# EAGLE design bop_pcb (EAGLE 9.6.2)
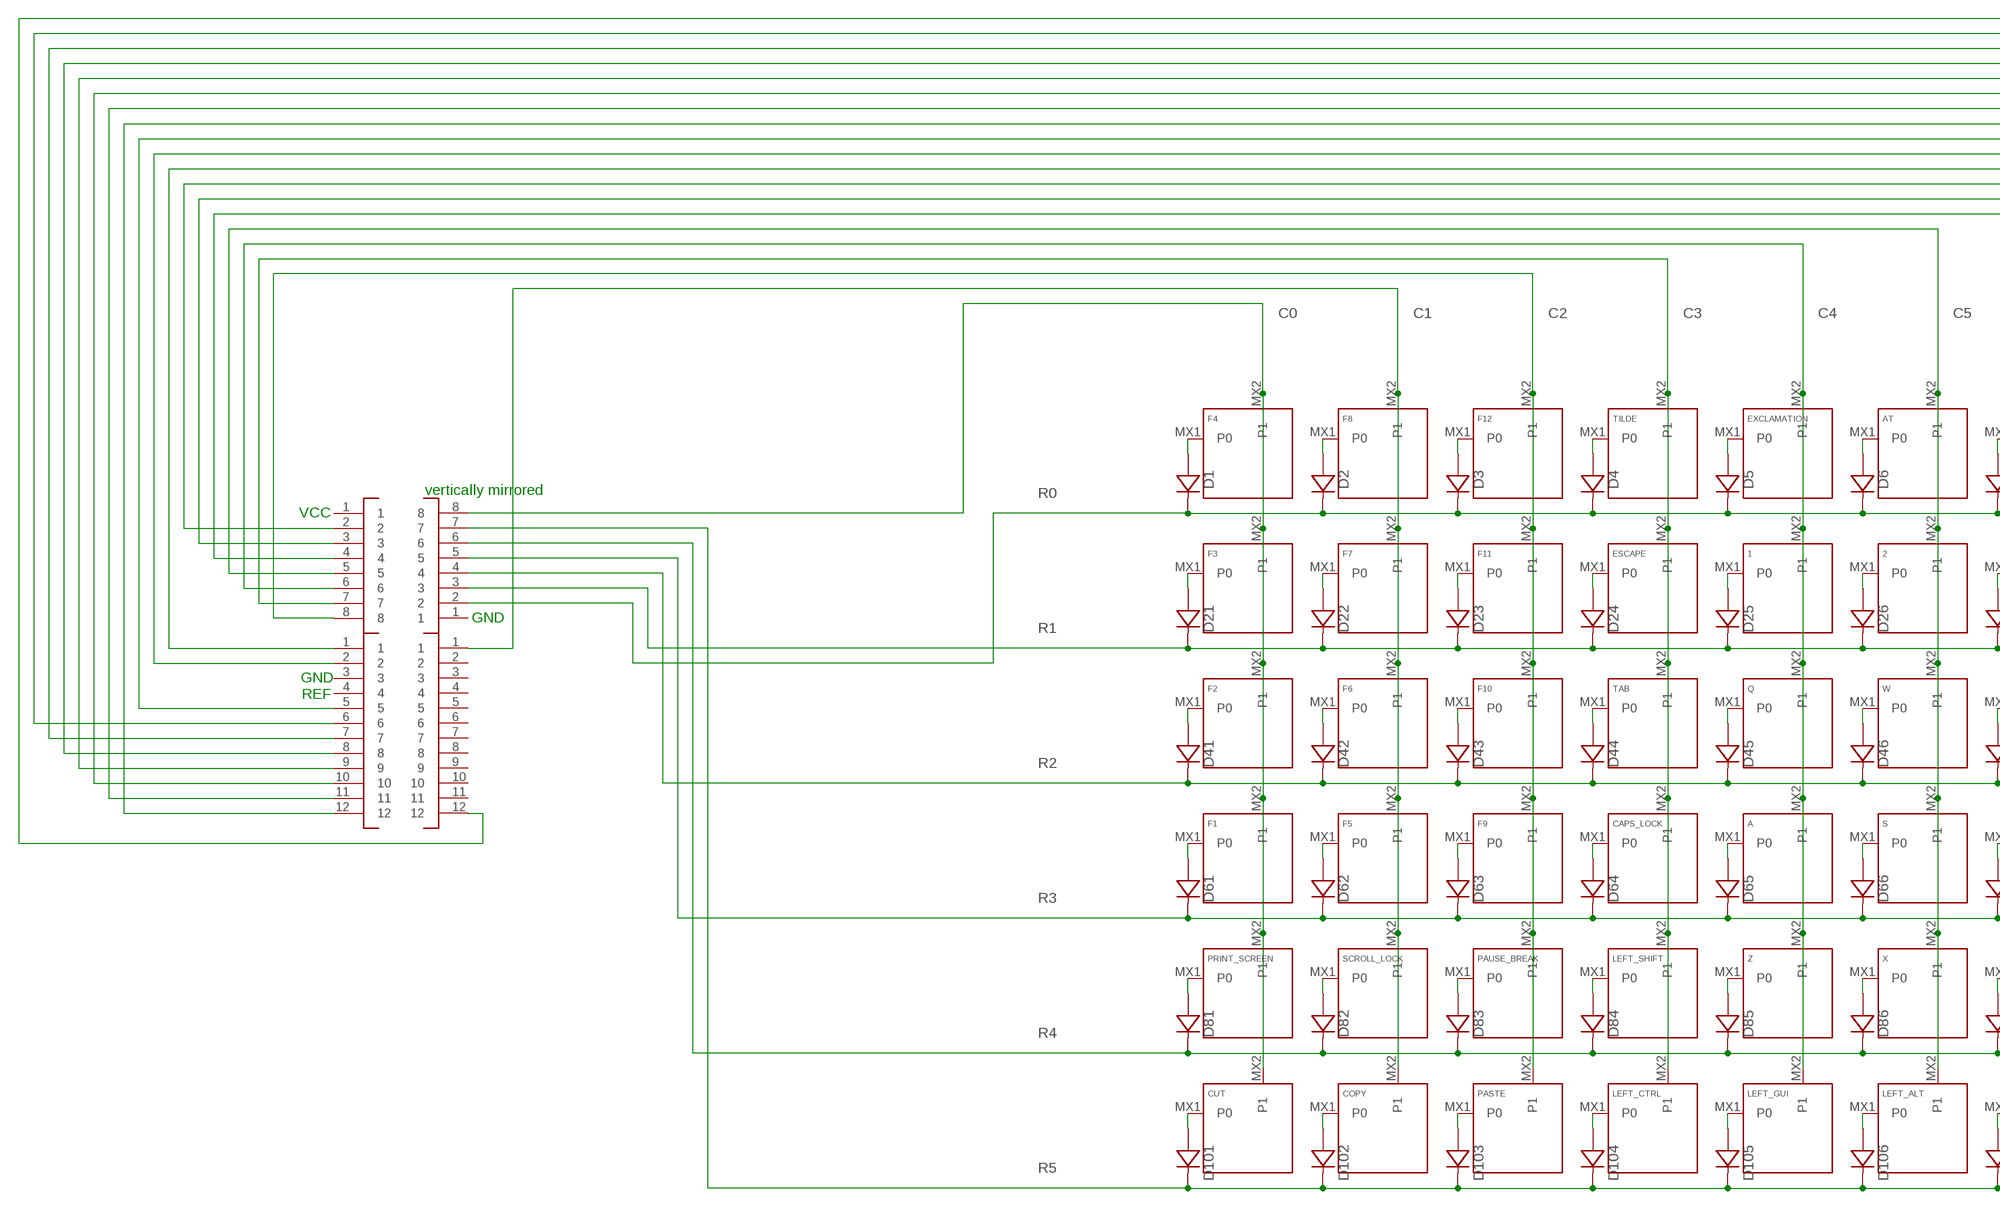
[diagram p0: schematic, sheet 1, part 1 of 2]
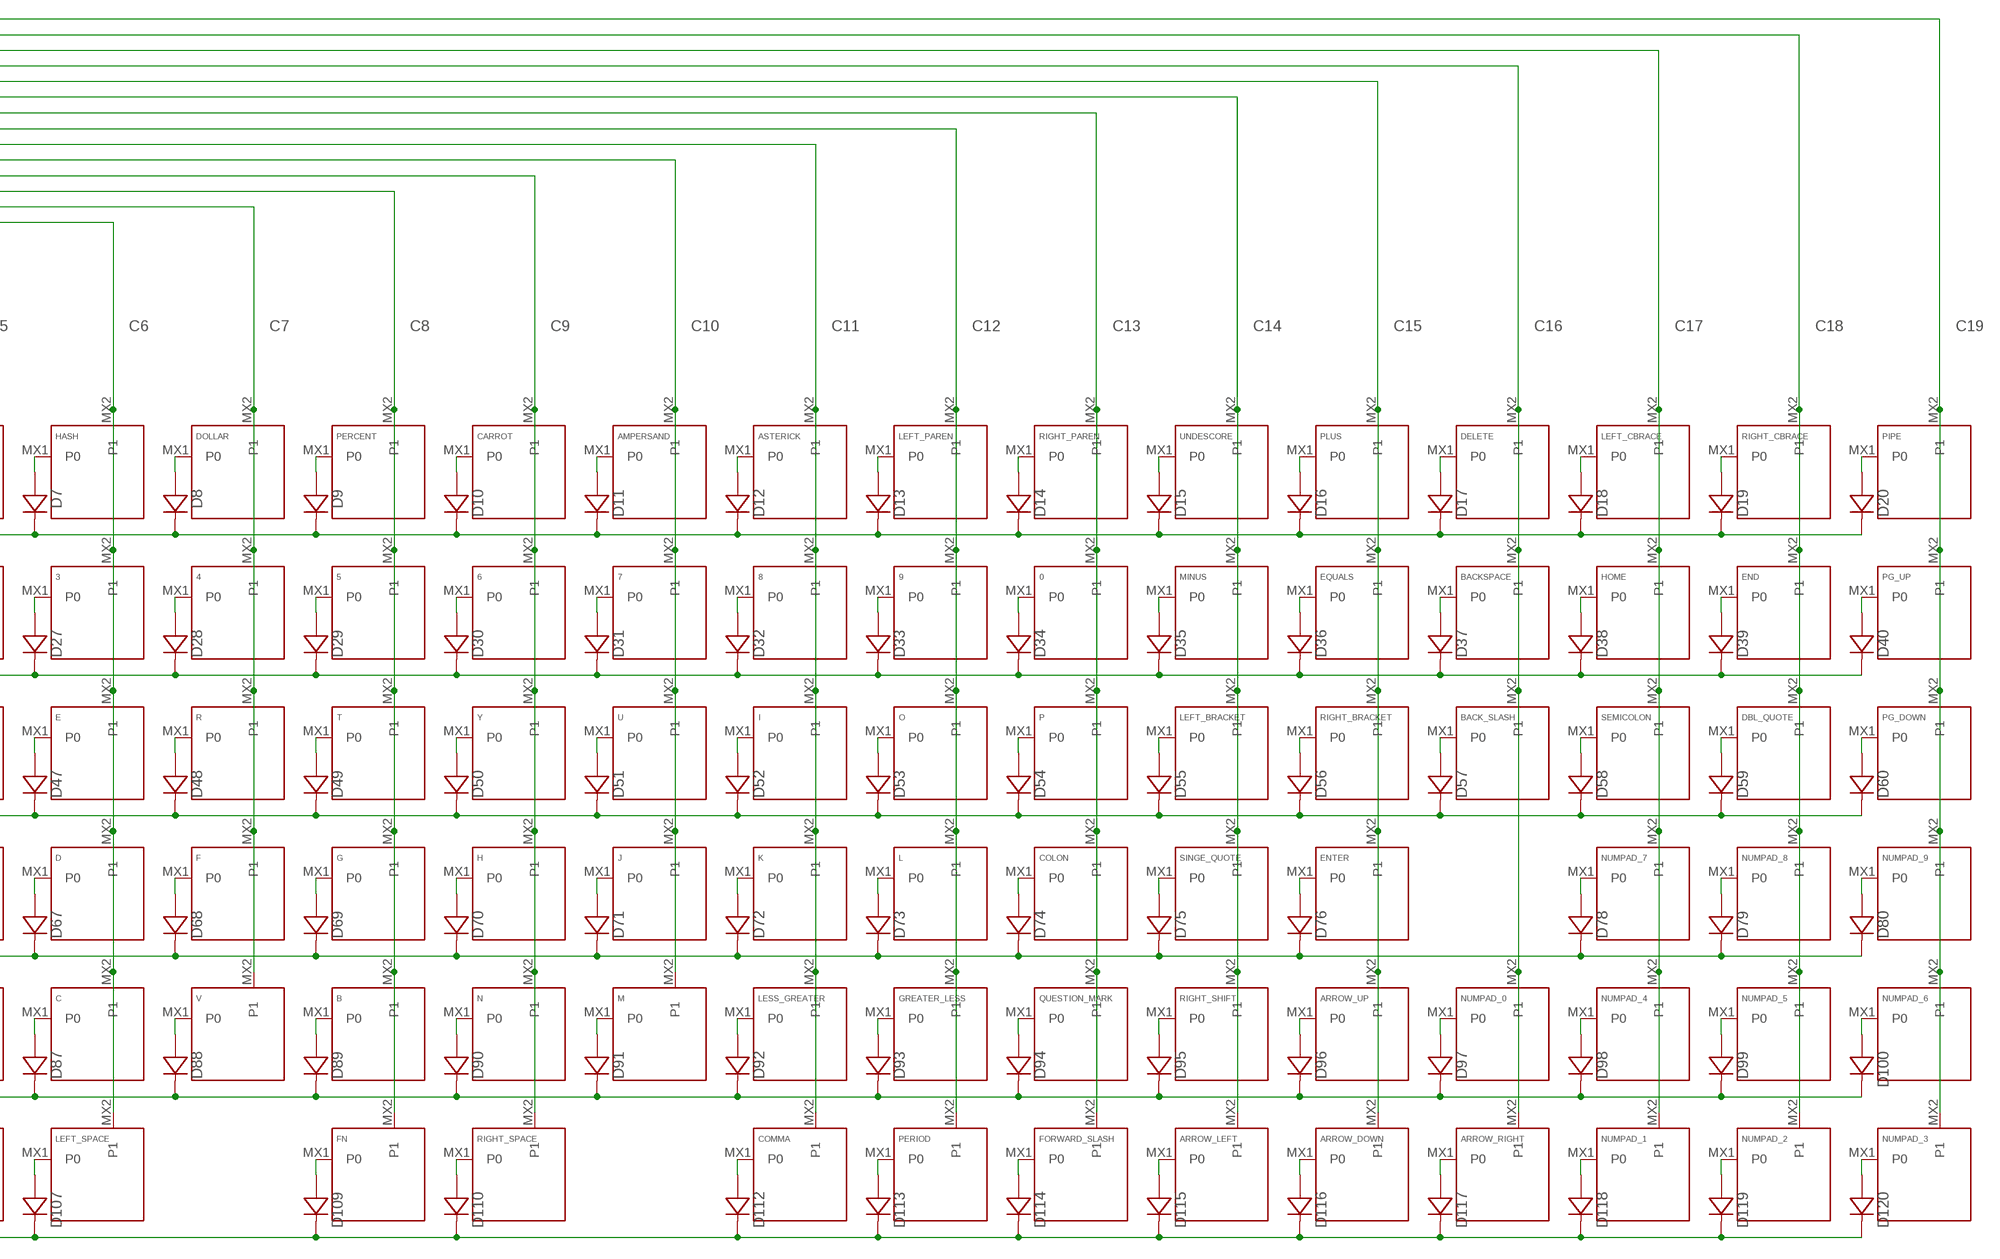
[diagram p1: schematic, sheet 1, part 2 of 2]

## Parts
0  KEYSWITCH-PLAIN-MX-1U  [MX-1U]
1  KEYSWITCH-PLAIN-MX-1U  [MX-1U]
2  KEYSWITCH-PLAIN-MX-1U  [MX-1U]
3  KEYSWITCH-PLAIN-MX-1U  [MX-1U]
4  KEYSWITCH-PLAIN-MX-1U  [MX-1U]
5  KEYSWITCH-PLAIN-MX-1U  [MX-1U]
6  KEYSWITCH-PLAIN-MX-1U  [MX-1U]
7  KEYSWITCH-PLAIN-MX-1U  [MX-1U]
8  KEYSWITCH-PLAIN-MX-1U  [MX-1U]
9  KEYSWITCH-PLAIN-MX-1U  [MX-1U]
A  KEYSWITCH-PLAIN-MX-1U  [MX-1U]
AMPERSAND  KEYSWITCH-PLAIN-MX-1U  [MX-1U]
ARROW_DOWN  KEYSWITCH-PLAIN-MX-1U  [MX-1U]
ARROW_LEFT  KEYSWITCH-PLAIN-MX-1U  [MX-1U]
ARROW_RIGHT  KEYSWITCH-PLAIN-MX-1U  [MX-1U]
ARROW_UP  KEYSWITCH-PLAIN-MX-1U  [MX-1U]
ASTERICK  KEYSWITCH-PLAIN-MX-1U  [MX-1U]
AT  KEYSWITCH-PLAIN-MX-1U  [MX-1U]
B  KEYSWITCH-PLAIN-MX-1U  [MX-1U]
BACK_SLASH  KEYSWITCH-PLAIN-MX-1U  [MX-1U]
BACKSPACE  KEYSWITCH-PLAIN-MX-1U  [MX-1U]
C  KEYSWITCH-PLAIN-MX-1U  [MX-1U]
CAPS_LOCK  KEYSWITCH-PLAIN-MX-1U  [MX-1U]
CARROT  KEYSWITCH-PLAIN-MX-1U  [MX-1U]
COLON  KEYSWITCH-PLAIN-MX-1U  [MX-1U]
COMMA  KEYSWITCH-PLAIN-MX-1U  [MX-1U]
COPY  KEYSWITCH-PLAIN-MX-1U  [MX-1U]
CUT  KEYSWITCH-PLAIN-MX-1U  [MX-1U]
D  KEYSWITCH-PLAIN-MX-1U  [MX-1U]
D1  DIODE-SOD-123  [SOD-123]
D2  DIODE-SOD-123  [SOD-123]
D3  DIODE-SOD-123  [SOD-123]
D4  DIODE-SOD-123  [SOD-123]
D5  DIODE-SOD-123  [SOD-123]
D6  DIODE-SOD-123  [SOD-123]
D7  DIODE-SOD-123  [SOD-123]
D8  DIODE-SOD-123  [SOD-123]
D9  DIODE-SOD-123  [SOD-123]
D10  DIODE-SOD-123  [SOD-123]
D11  DIODE-SOD-123  [SOD-123]
D12  DIODE-SOD-123  [SOD-123]
D13  DIODE-SOD-123  [SOD-123]
D14  DIODE-SOD-123  [SOD-123]
D15  DIODE-SOD-123  [SOD-123]
D16  DIODE-SOD-123  [SOD-123]
D17  DIODE-SOD-123  [SOD-123]
D18  DIODE-SOD-123  [SOD-123]
D19  DIODE-SOD-123  [SOD-123]
D20  DIODE-SOD-123  [SOD-123]
D21  DIODE-SOD-123  [SOD-123]
D22  DIODE-SOD-123  [SOD-123]
D23  DIODE-SOD-123  [SOD-123]
D24  DIODE-SOD-123  [SOD-123]
D25  DIODE-SOD-123  [SOD-123]
D26  DIODE-SOD-123  [SOD-123]
D27  DIODE-SOD-123  [SOD-123]
D28  DIODE-SOD-123  [SOD-123]
D29  DIODE-SOD-123  [SOD-123]
D30  DIODE-SOD-123  [SOD-123]
D31  DIODE-SOD-123  [SOD-123]
D32  DIODE-SOD-123  [SOD-123]
D33  DIODE-SOD-123  [SOD-123]
D34  DIODE-SOD-123  [SOD-123]
D35  DIODE-SOD-123  [SOD-123]
D36  DIODE-SOD-123  [SOD-123]
D37  DIODE-SOD-123  [SOD-123]
D38  DIODE-SOD-123  [SOD-123]
D39  DIODE-SOD-123  [SOD-123]
D40  DIODE-SOD-123  [SOD-123]
D41  DIODE-SOD-123  [SOD-123]
D42  DIODE-SOD-123  [SOD-123]
D43  DIODE-SOD-123  [SOD-123]
D44  DIODE-SOD-123  [SOD-123]
D45  DIODE-SOD-123  [SOD-123]
D46  DIODE-SOD-123  [SOD-123]
D47  DIODE-SOD-123  [SOD-123]
D48  DIODE-SOD-123  [SOD-123]
D49  DIODE-SOD-123  [SOD-123]
D50  DIODE-SOD-123  [SOD-123]
D51  DIODE-SOD-123  [SOD-123]
D52  DIODE-SOD-123  [SOD-123]
D53  DIODE-SOD-123  [SOD-123]
D54  DIODE-SOD-123  [SOD-123]
D55  DIODE-SOD-123  [SOD-123]
D56  DIODE-SOD-123  [SOD-123]
D57  DIODE-SOD-123  [SOD-123]
D58  DIODE-SOD-123  [SOD-123]
D59  DIODE-SOD-123  [SOD-123]
D60  DIODE-SOD-123  [SOD-123]
D61  DIODE-SOD-123  [SOD-123]
D62  DIODE-SOD-123  [SOD-123]
D63  DIODE-SOD-123  [SOD-123]
D64  DIODE-SOD-123  [SOD-123]
D65  DIODE-SOD-123  [SOD-123]
D66  DIODE-SOD-123  [SOD-123]
D67  DIODE-SOD-123  [SOD-123]
D68  DIODE-SOD-123  [SOD-123]
D69  DIODE-SOD-123  [SOD-123]
D70  DIODE-SOD-123  [SOD-123]
D71  DIODE-SOD-123  [SOD-123]
D72  DIODE-SOD-123  [SOD-123]
D73  DIODE-SOD-123  [SOD-123]
D74  DIODE-SOD-123  [SOD-123]
D75  DIODE-SOD-123  [SOD-123]
D76  DIODE-SOD-123  [SOD-123]
D78  DIODE-SOD-123  [SOD-123]
D79  DIODE-SOD-123  [SOD-123]
D80  DIODE-SOD-123  [SOD-123]
D81  DIODE-SOD-123  [SOD-123]
D82  DIODE-SOD-123  [SOD-123]
D83  DIODE-SOD-123  [SOD-123]
D84  DIODE-SOD-123  [SOD-123]
D85  DIODE-SOD-123  [SOD-123]
D86  DIODE-SOD-123  [SOD-123]
D87  DIODE-SOD-123  [SOD-123]
D88  DIODE-SOD-123  [SOD-123]
D89  DIODE-SOD-123  [SOD-123]
D90  DIODE-SOD-123  [SOD-123]
D91  DIODE-SOD-123  [SOD-123]
D92  DIODE-SOD-123  [SOD-123]
D93  DIODE-SOD-123  [SOD-123]
D94  DIODE-SOD-123  [SOD-123]
D95  DIODE-SOD-123  [SOD-123]
D96  DIODE-SOD-123  [SOD-123]
D97  DIODE-SOD-123  [SOD-123]
D98  DIODE-SOD-123  [SOD-123]
D99  DIODE-SOD-123  [SOD-123]
D100  DIODE-SOD-123  [SOD-123]
D101  DIODE-SOD-123  [SOD-123]
D102  DIODE-SOD-123  [SOD-123]
D103  DIODE-SOD-123  [SOD-123]
D104  DIODE-SOD-123  [SOD-123]
D105  DIODE-SOD-123  [SOD-123]
D106  DIODE-SOD-123  [SOD-123]
D107  DIODE-SOD-123  [SOD-123]
D109  DIODE-SOD-123  [SOD-123]
D110  DIODE-SOD-123  [SOD-123]
D112  DIODE-SOD-123  [SOD-123]
D113  DIODE-SOD-123  [SOD-123]
D114  DIODE-SOD-123  [SOD-123]
D115  DIODE-SOD-123  [SOD-123]
D116  DIODE-SOD-123  [SOD-123]
D117  DIODE-SOD-123  [SOD-123]
D118  DIODE-SOD-123  [SOD-123]
D119  DIODE-SOD-123  [SOD-123]
D120  DIODE-SOD-123  [SOD-123]
DBL_QUOTE  KEYSWITCH-PLAIN-MX-1U  [MX-1U]
DELETE  KEYSWITCH-PLAIN-MX-1U  [MX-1U]
DOLLAR  KEYSWITCH-PLAIN-MX-1U  [MX-1U]
E  KEYSWITCH-PLAIN-MX-1U  [MX-1U]
END  KEYSWITCH-PLAIN-MX-1U  [MX-1U]
ENTER  KEYSWITCH-PLAIN-MX-1U  [MX-1U]
EQUALS  KEYSWITCH-PLAIN-MX-1U  [MX-1U]
ESCAPE  KEYSWITCH-PLAIN-MX-1U  [MX-1U]
EXCLAMATION  KEYSWITCH-PLAIN-MX-1U  [MX-1U]
F  KEYSWITCH-PLAIN-MX-1U  [MX-1U]
F1  KEYSWITCH-PLAIN-MX-1U  [MX-1U]
F2  KEYSWITCH-PLAIN-MX-1U  [MX-1U]
F3  KEYSWITCH-PLAIN-MX-1U  [MX-1U]
F4  KEYSWITCH-PLAIN-MX-1U  [MX-1U]
F5  KEYSWITCH-PLAIN-MX-1U  [MX-1U]
F6  KEYSWITCH-PLAIN-MX-1U  [MX-1U]
F7  KEYSWITCH-PLAIN-MX-1U  [MX-1U]
F8  KEYSWITCH-PLAIN-MX-1U  [MX-1U]
F9  KEYSWITCH-PLAIN-MX-1U  [MX-1U]
F10  KEYSWITCH-PLAIN-MX-1U  [MX-1U]
F11  KEYSWITCH-PLAIN-MX-1U  [MX-1U]
F12  KEYSWITCH-PLAIN-MX-1U  [MX-1U]
FN  KEYSWITCH-PLAIN-MX-1U  [MX-1U]
FORWARD_SLASH  KEYSWITCH-PLAIN-MX-1U  [MX-1U]
G  KEYSWITCH-PLAIN-MX-1U  [MX-1U]
GREATER_LESS  KEYSWITCH-PLAIN-MX-1U  [MX-1U]
H  KEYSWITCH-PLAIN-MX-1U  [MX-1U]
HASH  KEYSWITCH-PLAIN-MX-1U  [MX-1U]
HOME  KEYSWITCH-PLAIN-MX-1U  [MX-1U]
I  KEYSWITCH-PLAIN-MX-1U  [MX-1U]
J  KEYSWITCH-PLAIN-MX-1U  [MX-1U]
J1  HEADER-12X1-2.54-ROUND  [HEADER-12X1-2.54-ROUND]
J2  HEADER-12X1-2.54-ROUND  [HEADER-12X1-2.54-ROUND]
K  KEYSWITCH-PLAIN-MX-1U  [MX-1U]
L  KEYSWITCH-PLAIN-MX-1U  [MX-1U]
LEFT_ALT  KEYSWITCH-PLAIN-MX-1U  [MX-1U]
LEFT_BRACKET  KEYSWITCH-PLAIN-MX-1U  [MX-1U]
LEFT_CBRACE  KEYSWITCH-PLAIN-MX-1U  [MX-1U]
LEFT_CTRL  KEYSWITCH-PLAIN-MX-1U  [MX-1U]
LEFT_GUI  KEYSWITCH-PLAIN-MX-1U  [MX-1U]
LEFT_PAREN  KEYSWITCH-PLAIN-MX-1U  [MX-1U]
LEFT_SHIFT  KEYSWITCH-PLAIN-MX-1U  [MX-1U]
LEFT_SPACE  KEYSWITCH-PLAIN-MX-2U-FLIPPED  [MX-2U-FLIPPED]
LESS_GREATER  KEYSWITCH-PLAIN-MX-1U  [MX-1U]
M  KEYSWITCH-PLAIN-MX-1U  [MX-1U]
MINUS  KEYSWITCH-PLAIN-MX-1U  [MX-1U]
N  KEYSWITCH-PLAIN-MX-1U  [MX-1U]
NUMPAD_0  KEYSWITCH-PLAIN-MX-2U-ROTATED  [MX-2U-ROTATED]
NUMPAD_1  KEYSWITCH-PLAIN-MX-1U  [MX-1U]
NUMPAD_2  KEYSWITCH-PLAIN-MX-1U  [MX-1U]
NUMPAD_3  KEYSWITCH-PLAIN-MX-1U  [MX-1U]
NUMPAD_4  KEYSWITCH-PLAIN-MX-1U  [MX-1U]
NUMPAD_5  KEYSWITCH-PLAIN-MX-1U  [MX-1U]
NUMPAD_6  KEYSWITCH-PLAIN-MX-1U  [MX-1U]
NUMPAD_7  KEYSWITCH-PLAIN-MX-1U  [MX-1U]
NUMPAD_8  KEYSWITCH-PLAIN-MX-1U  [MX-1U]
NUMPAD_9  KEYSWITCH-PLAIN-MX-1U  [MX-1U]
O  KEYSWITCH-PLAIN-MX-1U  [MX-1U]
P  KEYSWITCH-PLAIN-MX-1U  [MX-1U]
PASTE  KEYSWITCH-PLAIN-MX-1U  [MX-1U]
PAUSE_BREAK  KEYSWITCH-PLAIN-MX-1U  [MX-1U]
PERCENT  KEYSWITCH-PLAIN-MX-1U  [MX-1U]
PERIOD  KEYSWITCH-PLAIN-MX-1U  [MX-1U]
PG_DOWN  KEYSWITCH-PLAIN-MX-1U  [MX-1U]
PG_UP  KEYSWITCH-PLAIN-MX-1U  [MX-1U]
PIPE  KEYSWITCH-PLAIN-MX-1U  [MX-1U]
PLUS  KEYSWITCH-PLAIN-MX-1U  [MX-1U]
PRINT_SCREEN  KEYSWITCH-PLAIN-MX-1U  [MX-1U]
Q  KEYSWITCH-PLAIN-MX-1U  [MX-1U]
QUESTION_MARK  KEYSWITCH-PLAIN-MX-1U  [MX-1U]
R  KEYSWITCH-PLAIN-MX-1U  [MX-1U]
RIGHT_BRACKET  KEYSWITCH-PLAIN-MX-1U  [MX-1U]
RIGHT_CBRACE  KEYSWITCH-PLAIN-MX-1U  [MX-1U]
RIGHT_PAREN  KEYSWITCH-PLAIN-MX-1U  [MX-1U]
RIGHT_SHIFT  KEYSWITCH-PLAIN-MX-1U  [MX-1U]
RIGHT_SPACE  KEYSWITCH-PLAIN-MX-2U-FLIPPED  [MX-2U-FLIPPED]
S  KEYSWITCH-PLAIN-MX-1U  [MX-1U]
SCROLL_LOCK  KEYSWITCH-PLAIN-MX-1U  [MX-1U]
SEMICOLON  KEYSWITCH-PLAIN-MX-1U  [MX-1U]
SINGE_QUOTE  KEYSWITCH-PLAIN-MX-1U  [MX-1U]
T  KEYSWITCH-PLAIN-MX-1U  [MX-1U]
TAB  KEYSWITCH-PLAIN-MX-1U  [MX-1U]
TILDE  KEYSWITCH-PLAIN-MX-1U  [MX-1U]
U  KEYSWITCH-PLAIN-MX-1U  [MX-1U]
U$1  HEADER-8X1-2.54  [HEADER-8X1-2.54]
U$2  HEADER-8X1-2.54  [HEADER-8X1-2.54]
UNDESCORE  KEYSWITCH-PLAIN-MX-1U  [MX-1U]
V  KEYSWITCH-PLAIN-MX-1U  [MX-1U]
W  KEYSWITCH-PLAIN-MX-1U  [MX-1U]
X  KEYSWITCH-PLAIN-MX-1U  [MX-1U]
Y  KEYSWITCH-PLAIN-MX-1U  [MX-1U]
Z  KEYSWITCH-PLAIN-MX-1U  [MX-1U]

## Nets
C0: CUT.MX2(P1) F1.MX2(P1) F2.MX2(P1) F3.MX2(P1) F4.MX2(P1) PRINT_SCREEN.MX2(P1) U$2.8
C1: COPY.MX2(P1) F5.MX2(P1) F6.MX2(P1) F7.MX2(P1) F8.MX2(P1) J1.1 SCROLL_LOCK.MX2(P1)
C2: F9.MX2(P1) F10.MX2(P1) F11.MX2(P1) F12.MX2(P1) PASTE.MX2(P1) PAUSE_BREAK.MX2(P1) U$1.8
C3: CAPS_LOCK.MX2(P1) ESCAPE.MX2(P1) LEFT_CTRL.MX2(P1) LEFT_SHIFT.MX2(P1) TAB.MX2(P1) TILDE.MX2(P1) U$1.7
C4: 1.MX2(P1) A.MX2(P1) EXCLAMATION.MX2(P1) LEFT_GUI.MX2(P1) Q.MX2(P1) U$1.6 Z.MX2(P1)
C5: 2.MX2(P1) AT.MX2(P1) LEFT_ALT.MX2(P1) S.MX2(P1) U$1.5 W.MX2(P1) X.MX2(P1)
C6: 3.MX2(P1) C.MX2(P1) D.MX2(P1) E.MX2(P1) HASH.MX2(P1) LEFT_SPACE.MX2(P1) U$1.4
C7: 4.MX2(P1) DOLLAR.MX2(P1) F.MX2(P1) R.MX2(P1) U$1.3 V.MX2(P1)
C8: 5.MX2(P1) B.MX2(P1) FN.MX2(P1) G.MX2(P1) PERCENT.MX2(P1) T.MX2(P1) U$1.2
C9: 6.MX2(P1) CARROT.MX2(P1) H.MX2(P1) J2.1 N.MX2(P1) RIGHT_SPACE.MX2(P1) Y.MX2(P1)
C10: 7.MX2(P1) AMPERSAND.MX2(P1) J2.2 J.MX2(P1) M.MX2(P1) U.MX2(P1)
C11: 8.MX2(P1) ASTERICK.MX2(P1) COMMA.MX2(P1) I.MX2(P1) J2.5 K.MX2(P1) LESS_GREATER.MX2(P1)
C12: 9.MX2(P1) GREATER_LESS.MX2(P1) J2.12 L.MX2(P1) LEFT_PAREN.MX2(P1) O.MX2(P1) PERIOD.MX2(P1)
C13: 0.MX2(P1) COLON.MX2(P1) FORWARD_SLASH.MX2(P1) J2.11 P.MX2(P1) QUESTION_MARK.MX2(P1) RIGHT_PAREN.MX2(P1)
C14: ARROW_LEFT.MX2(P1) J2.10 LEFT_BRACKET.MX2(P1) MINUS.MX2(P1) RIGHT_SHIFT.MX2(P1) SINGE_QUOTE.MX2(P1) UNDESCORE.MX2(P1)
C15: ARROW_DOWN.MX2(P1) ARROW_UP.MX2(P1) ENTER.MX2(P1) EQUALS.MX2(P1) J2.9 PLUS.MX2(P1) RIGHT_BRACKET.MX2(P1)
C16: ARROW_RIGHT.MX2(P1) BACK_SLASH.MX2(P1) BACKSPACE.MX2(P1) DELETE.MX2(P1) J2.8 NUMPAD_0.MX2(P1)
C17: HOME.MX2(P1) J2.7 LEFT_CBRACE.MX2(P1) NUMPAD_1.MX2(P1) NUMPAD_4.MX2(P1) NUMPAD_7.MX2(P1) SEMICOLON.MX2(P1)
C18: DBL_QUOTE.MX2(P1) END.MX2(P1) J2.6 NUMPAD_2.MX2(P1) NUMPAD_5.MX2(P1) NUMPAD_8.MX2(P1) RIGHT_CBRACE.MX2(P1)
C19: J1.12 NUMPAD_3.MX2(P1) NUMPAD_6.MX2(P1) NUMPAD_9.MX2(P1) PG_DOWN.MX2(P1) PG_UP.MX2(P1) PIPE.MX2(P1)
N$1: D1.A F4.MX1(P0)
N$2: D2.A F8.MX1(P0)
N$3: D3.A F12.MX1(P0)
N$4: D4.A TILDE.MX1(P0)
N$5: D5.A EXCLAMATION.MX1(P0)
N$6: AT.MX1(P0) D6.A
N$7: D7.A HASH.MX1(P0)
N$8: D8.A DOLLAR.MX1(P0)
N$9: D9.A PERCENT.MX1(P0)
N$10: CARROT.MX1(P0) D10.A
N$11: AMPERSAND.MX1(P0) D11.A
N$12: ASTERICK.MX1(P0) D12.A
N$13: D13.A LEFT_PAREN.MX1(P0)
N$14: D14.A RIGHT_PAREN.MX1(P0)
N$15: D15.A UNDESCORE.MX1(P0)
N$16: D16.A PLUS.MX1(P0)
N$17: D17.A DELETE.MX1(P0)
N$18: D18.A LEFT_CBRACE.MX1(P0)
N$19: D19.A RIGHT_CBRACE.MX1(P0)
N$20: D20.A PIPE.MX1(P0)
N$21: D21.A F3.MX1(P0)
N$22: D22.A F7.MX1(P0)
N$23: D23.A F11.MX1(P0)
N$24: D24.A ESCAPE.MX1(P0)
N$25: 1.MX1(P0) D25.A
N$26: 2.MX1(P0) D26.A
N$27: 3.MX1(P0) D27.A
N$28: 4.MX1(P0) D28.A
N$29: 5.MX1(P0) D29.A
N$30: 6.MX1(P0) D30.A
N$31: 7.MX1(P0) D31.A
N$32: 8.MX1(P0) D32.A
N$33: 9.MX1(P0) D33.A
N$34: 0.MX1(P0) D34.A
N$35: D35.A MINUS.MX1(P0)
N$36: D36.A EQUALS.MX1(P0)
N$37: BACKSPACE.MX1(P0) D37.A
N$38: D38.A HOME.MX1(P0)
N$39: D39.A END.MX1(P0)
N$40: D40.A PG_UP.MX1(P0)
N$41: D41.A F2.MX1(P0)
N$42: D42.A F6.MX1(P0)
N$43: D43.A F10.MX1(P0)
N$44: D44.A TAB.MX1(P0)
N$45: D45.A Q.MX1(P0)
N$46: D46.A W.MX1(P0)
N$47: D47.A E.MX1(P0)
N$48: D48.A R.MX1(P0)
N$49: D49.A T.MX1(P0)
N$50: D50.A Y.MX1(P0)
N$51: D51.A U.MX1(P0)
N$52: D52.A I.MX1(P0)
N$53: D53.A O.MX1(P0)
N$54: D54.A P.MX1(P0)
N$55: D55.A LEFT_BRACKET.MX1(P0)
N$56: D56.A RIGHT_BRACKET.MX1(P0)
N$57: BACK_SLASH.MX1(P0) D57.A
N$58: D58.A SEMICOLON.MX1(P0)
N$59: D59.A DBL_QUOTE.MX1(P0)
N$60: D60.A PG_DOWN.MX1(P0)
N$61: D61.A F1.MX1(P0)
N$62: D62.A F5.MX1(P0)
N$63: D63.A F9.MX1(P0)
N$64: CAPS_LOCK.MX1(P0) D64.A
N$65: A.MX1(P0) D65.A
N$66: D66.A S.MX1(P0)
N$67: D67.A D.MX1(P0)
N$68: D68.A F.MX1(P0)
N$69: D69.A G.MX1(P0)
N$70: D70.A H.MX1(P0)
N$71: D71.A J.MX1(P0)
N$72: D72.A K.MX1(P0)
N$73: D73.A L.MX1(P0)
N$74: COLON.MX1(P0) D74.A
N$75: D75.A SINGE_QUOTE.MX1(P0)
N$76: D76.A ENTER.MX1(P0)
N$77: D78.A NUMPAD_7.MX1(P0)
N$78: D79.A NUMPAD_8.MX1(P0)
N$79: D80.A NUMPAD_9.MX1(P0)
N$80: D81.A PRINT_SCREEN.MX1(P0)
N$81: D82.A SCROLL_LOCK.MX1(P0)
N$82: D83.A PAUSE_BREAK.MX1(P0)
N$83: D84.A LEFT_SHIFT.MX1(P0)
N$84: D85.A Z.MX1(P0)
N$85: D86.A X.MX1(P0)
N$86: C.MX1(P0) D87.A
N$87: D88.A V.MX1(P0)
N$88: B.MX1(P0) D89.A
N$89: D90.A N.MX1(P0)
N$90: D91.A M.MX1(P0)
N$91: D92.A LESS_GREATER.MX1(P0)
N$92: D93.A GREATER_LESS.MX1(P0)
N$93: D94.A QUESTION_MARK.MX1(P0)
N$94: D95.A RIGHT_SHIFT.MX1(P0)
N$95: ARROW_UP.MX1(P0) D96.A
N$96: D97.A NUMPAD_0.MX1(P0)
N$97: D98.A NUMPAD_4.MX1(P0)
N$98: D99.A NUMPAD_5.MX1(P0)
N$99: D100.A NUMPAD_6.MX1(P0)
N$100: CUT.MX1(P0) D101.A
N$101: COPY.MX1(P0) D102.A
N$102: D103.A PASTE.MX1(P0)
N$103: D104.A LEFT_CTRL.MX1(P0)
N$104: D105.A LEFT_GUI.MX1(P0)
N$105: D106.A LEFT_ALT.MX1(P0)
N$106: D107.A LEFT_SPACE.MX1(P0)
N$107: D109.A FN.MX1(P0)
N$108: D110.A RIGHT_SPACE.MX1(P0)
N$109: COMMA.MX1(P0) D112.A
N$110: D113.A PERIOD.MX1(P0)
N$111: D114.A FORWARD_SLASH.MX1(P0)
N$112: ARROW_LEFT.MX1(P0) D115.A
N$113: ARROW_DOWN.MX1(P0) D116.A
N$114: ARROW_RIGHT.MX1(P0) D117.A
N$115: D118.A NUMPAD_1.MX1(P0)
N$116: D119.A NUMPAD_2.MX1(P0)
N$117: D120.A NUMPAD_3.MX1(P0)
R0: D1.C D2.C D3.C D4.C D5.C D6.C D7.C D8.C D9.C D10.C D11.C D12.C D13.C D14.C D15.C D16.C D17.C D18.C D19.C D20.C U$2.2
R1: D21.C D22.C D23.C D24.C D25.C D26.C D27.C D28.C D29.C D30.C D31.C D32.C D33.C D34.C D35.C D36.C D37.C D38.C D39.C D40.C U$2.3
R2: D41.C D42.C D43.C D44.C D45.C D46.C D47.C D48.C D49.C D50.C D51.C D52.C D53.C D54.C D55.C D56.C D57.C D58.C D59.C D60.C U$2.4
R3: D61.C D62.C D63.C D64.C D65.C D66.C D67.C D68.C D69.C D70.C D71.C D72.C D73.C D74.C D75.C D76.C D78.C D79.C D80.C U$2.5
R4: D81.C D82.C D83.C D84.C D85.C D86.C D87.C D88.C D89.C D90.C D91.C D92.C D93.C D94.C D95.C D96.C D97.C D98.C D99.C D100.C U$2.6
R5: D101.C D102.C D103.C D104.C D105.C D106.C D107.C D109.C D110.C D112.C D113.C D114.C D115.C D116.C D117.C D118.C D119.C D120.C U$2.7
Unconnected: J1.2 J1.3 J1.4 J1.5 J1.6 J1.7 J1.8 J1.9 J1.10 J1.11 J2.3 J2.4 U$1.1 U$2.1

## Notes on the sheet
- vertically mirrored
- VCC
- GND
- GND
- REF

## Library data of the parts
0 1-9 A AMPERSAND ARROW_DOWN ARROW_LEFT ARROW_RIGHT ARROW_UP ASTERICK AT B BACK_SLASH BACKSPACE C CAPS_LOCK CARROT COLON COMMA COPY CUT D DBL_QUOTE DELETE DOLLAR E END ENTER EQUALS ESCAPE EXCLAMATION F F1-F12 FN FORWARD_SLASH G GREATER_LESS H HASH HOME I J K L LEFT_ALT LEFT_BRACKET LEFT_CBRACE LEFT_CTRL LEFT_GUI LEFT_PAREN LEFT_SHIFT LEFT_SPACE LESS_GREATER M MINUS N NUMPAD_0 NUMPAD_1-NUMPAD_9 O P PASTE PAUSE_BREAK PERCENT PERIOD PG_DOWN PG_UP PIPE PLUS PRINT_SCREEN Q QUESTION_MARK R RIGHT_BRACKET RIGHT_CBRACE RIGHT_PAREN RIGHT_SHIFT RIGHT_SPACE S SCROLL_LOCK SEMICOLON SINGE_QUOTE T TAB TILDE U UNDESCORE V W X Y Z = Keyboard:KEYSWITCH-PLAIN
D1-D76 D78-D107 D109 D110 D112-D120 = Components:DIODE: Standard 1N4148 diode
J1 J2 = Controller:HEADER-12X1
U$1 U$2 = Controller:HEADER-8X1

## Board
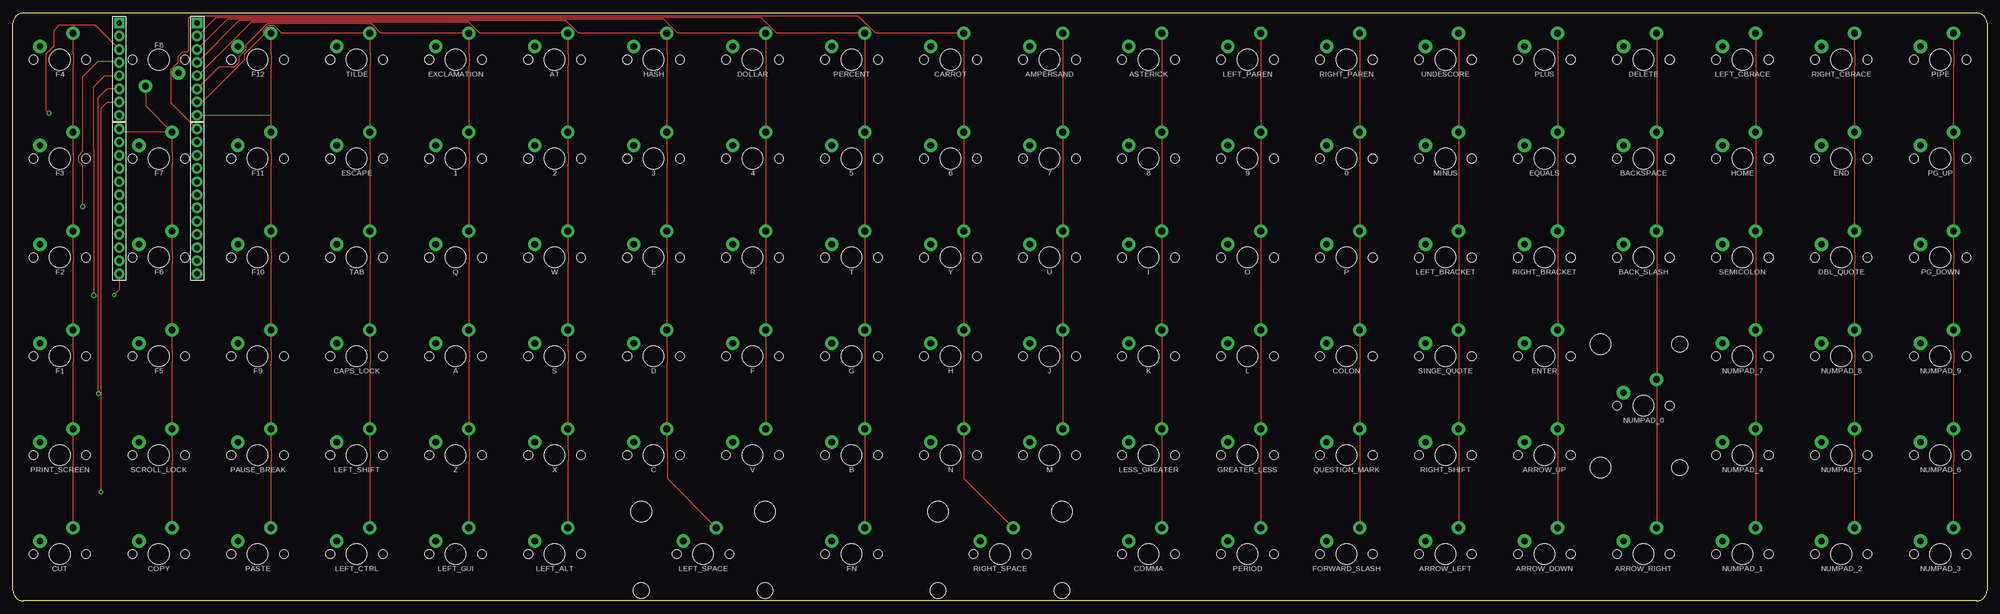
[diagram p2: board, top side]
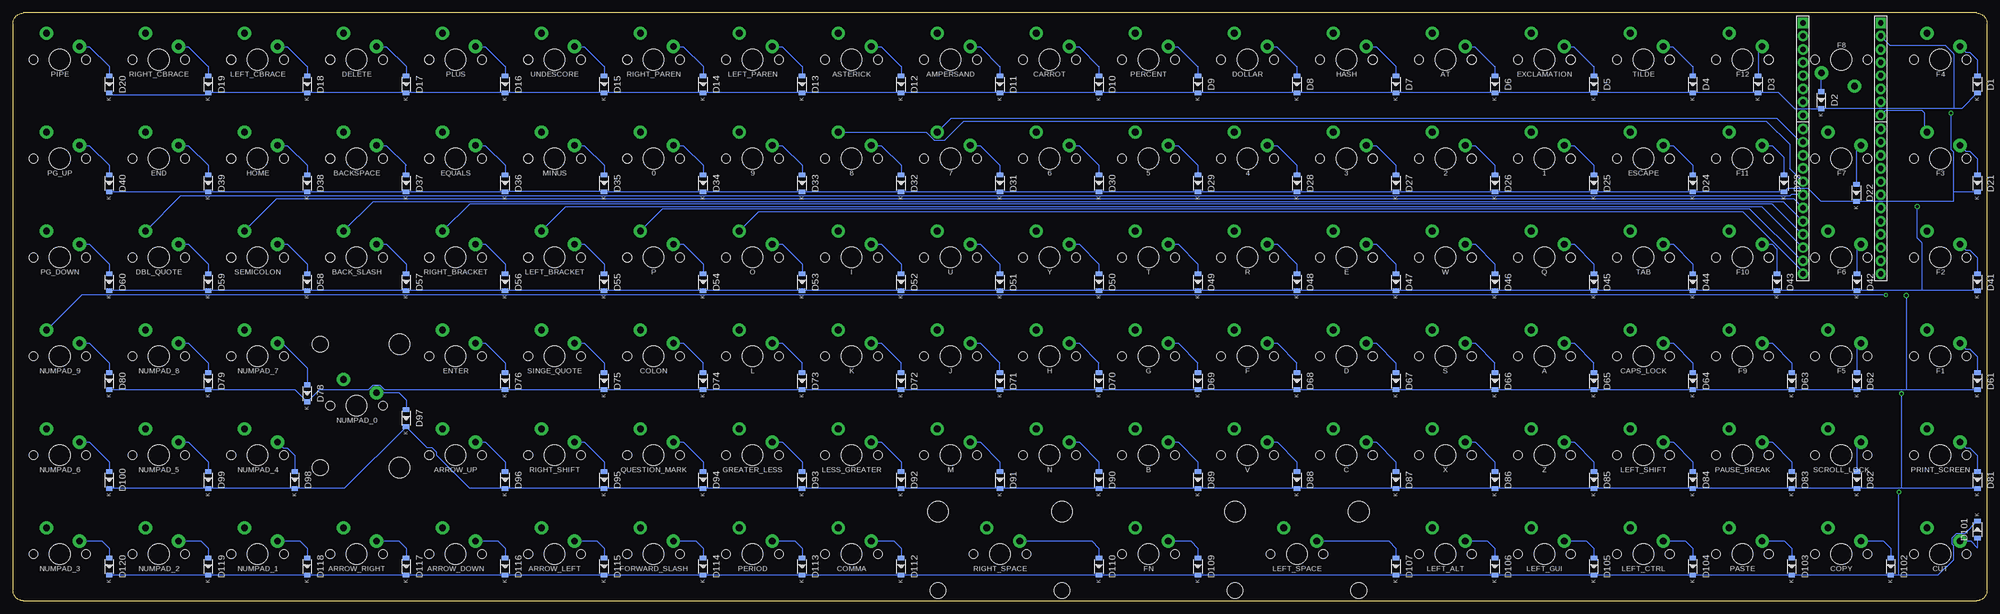
[diagram p3: board, bottom side, seen from below]

Size 379.95 x 113.25 mm. Coordinates in mm from the lower left corner, seen from the top.
Outline: 2,113.25 377.95,113.25 arc-90 379.95,111.25 379.95,2 arc-90 377.95,0 2,0 arc-90 0,2 0,111.25 arc-90 2,113.25
Copper layers (1*16): Top 0.035mm / dielectric 1.5mm / Bottom 0.035mm
Design rules "default *": minimum track width 6mil, minimum drill 0.35mm, track to track 6mil, track to pad 6mil, pad to pad 6mil, via to via 6mil, smd to smd 6mil, copper to edge 20mil, drill to drill 6mil, minimum pad ring 10mil, minimum via ring 8mil, stop-mask expansion 4mil, vias tented up to drill 0mil, thermal gap 10mil

### Footprints (pad centres in the part's own frame; a part is rotated, then mirrored left to right if it is on the bottom)
MX-1U = drill 1.3 pad 2.54: MX1 -3.81,2.54; MX2 2.54,5.08 | hole 4: 0,0 | hole 1.7: -5.08,0; 5.08,0
SOD-123 = smd 0.91 x 1.22: A -1.635,0; C 1.635,0
HEADER-12X1-2.54-ROUND = drill 1.05 pad 2: 1 -13.97,0; 2 -11.43,0; 3 -8.89,0; 4 -6.35,0; 5 -3.81,0; 6 -1.27,0; 7 1.27,0; 8 3.81,0; 9 6.35,0; 10 8.89,0; 11 11.43,0; 12 13.97,0
MX-2U-FLIPPED = drill 1.3 pad 2.54: MX1 -3.81,2.54; MX2 2.54,5.08 | hole 4: 0,0; -11.9,8.24; 11.9,8.24 | hole 1.7: -5.08,0; 5.08,0 | hole 3.05: -11.9,-7; 11.9,-7
MX-2U-ROTATED = drill 1.3 pad 2.54: MX1 -3.81,2.54; MX2 2.54,5.08 | hole 4: 0,0; -8.24,-11.9; -8.24,11.9 | hole 1.7: -5.08,0; 5.08,0 | hole 3.05: 7,-11.9; 7,11.9
HEADER-8X1-2.54 = drill 1.05 pad 2 square: 1 -8.89,0 | drill 1.05 pad 2: 2 -6.35,0; 3 -3.81,0; 4 -1.27,0; 5 1.27,0; 6 3.81,0; 7 6.35,0; 8 8.89,0

### Placement (x,y rotation side)
0  256.65,85.2 0 top
1  85.2,85.2 0 top
2  104.25,85.2 0 top
3  123.3,85.2 0 top
4  142.35,85.2 0 top
5  161.4,85.2 0 top
6  180.45,85.2 0 top
7  199.5,85.2 0 top
8  218.55,85.2 0 top
9  237.6,85.2 0 top
A  85.2,47.1 0 top
AMPERSAND  199.5,104.25 0 top
ARROW_DOWN  294.75,9 0 top
ARROW_LEFT  275.7,9 0 top
ARROW_RIGHT  313.8,9 0 top
ARROW_UP  294.75,28.05 0 top
ASTERICK  218.55,104.25 0 top
AT  104.25,104.25 0 top
B  161.4,28.05 0 top
BACK_SLASH  313.8,66.15 0 top
BACKSPACE  313.8,85.2 0 top
C  123.3,28.05 0 top
CAPS_LOCK  66.15,47.1 0 top
CARROT  180.45,104.25 0 top
COLON  256.65,47.1 0 top
COMMA  218.55,9 0 top
COPY  28.05,9 0 top
CUT  9,9 0 top
D  123.3,47.1 0 top
D1  1.86,99.49 270 bottom
D2  31.9,96.45 270 bottom
D3  44.08,99.49 270 bottom
D4  56.62,99.49 270 bottom
D5  75.67,99.49 270 bottom
D6  94.73,99.49 270 bottom
D7  113.78,99.49 270 bottom
D8  132.82,99.49 270 bottom
D9  151.88,99.49 270 bottom
D10  170.92,99.49 270 bottom
D11  189.97,99.49 270 bottom
D12  209.02,99.49 270 bottom
D13  228.07,99.49 270 bottom
D14  247.12,99.49 270 bottom
D15  266.18,99.49 270 bottom
D16  285.22,99.49 270 bottom
D17  304.27,99.49 270 bottom
D18  323.32,99.49 270 bottom
D19  342.38,99.49 270 bottom
D20  361.43,99.49 270 bottom
D21  1.86,80.44 270 bottom
D22  25.12,78.59 270 bottom
D23  39.08,80.44 270 bottom
D24  56.62,80.44 270 bottom
D25  75.67,80.44 270 bottom
D26  94.73,80.44 270 bottom
D27  113.78,80.44 270 bottom
D28  132.82,80.44 270 bottom
D29  151.88,80.44 270 bottom
D30  170.92,80.44 270 bottom
D31  189.97,80.44 270 bottom
D32  209.02,80.44 270 bottom
D33  228.07,80.44 270 bottom
D34  247.12,80.44 270 bottom
D35  266.18,80.44 270 bottom
D36  285.22,80.44 270 bottom
D37  304.27,80.44 270 bottom
D38  323.32,80.44 270 bottom
D39  342.38,80.44 270 bottom
D40  361.43,80.44 270 bottom
D41  1.86,61.39 270 bottom
D42  25.03,61.39 270 bottom
D43  40.44,61.39 270 bottom
D44  56.62,61.39 270 bottom
D45  75.67,61.39 270 bottom
D46  94.73,61.39 270 bottom
D47  113.78,61.39 270 bottom
D48  132.82,61.39 270 bottom
D49  151.88,61.39 270 bottom
D50  170.92,61.39 270 bottom
D51  189.97,61.39 270 bottom
D52  209.02,61.39 270 bottom
D53  228.07,61.39 270 bottom
D54  247.12,61.39 270 bottom
D55  266.18,61.39 270 bottom
D56  285.22,61.39 270 bottom
D57  304.27,61.39 270 bottom
D58  323.32,61.39 270 bottom
D59  342.38,61.39 270 bottom
D60  361.43,61.39 270 bottom
D61  1.86,42.34 270 bottom
D62  25.03,42.34 270 bottom
D63  37.58,42.34 270 bottom
D64  56.62,42.34 270 bottom
D65  75.67,42.34 270 bottom
D66  94.73,42.34 270 bottom
D67  113.78,42.34 270 bottom
D68  132.82,42.34 270 bottom
D69  151.88,42.34 270 bottom
D70  170.92,42.34 270 bottom
D71  189.97,42.34 270 bottom
D72  209.02,42.34 270 bottom
D73  228.07,42.34 270 bottom
D74  247.12,42.34 270 bottom
D75  266.18,42.34 270 bottom
D76  285.22,42.34 270 bottom
D78  323.32,39.96 270 bottom
D79  342.38,42.34 270 bottom
D80  361.43,42.34 270 bottom
D81  1.86,23.29 270 bottom
D82  25.03,23.29 270 bottom
D83  37.58,23.29 270 bottom
D84  56.62,23.29 270 bottom
D85  75.67,23.29 270 bottom
D86  94.73,23.29 270 bottom
D87  113.78,23.29 270 bottom
D88  132.82,23.29 270 bottom
D89  151.88,23.29 270 bottom
D90  170.92,23.29 270 bottom
D91  189.97,23.29 270 bottom
D92  209.02,23.29 270 bottom
D93  228.07,23.29 270 bottom
D94  247.12,23.29 270 bottom
D95  266.18,23.29 270 bottom
D96  285.22,23.29 270 bottom
D97  304.27,35.19 270 bottom
D98  325.71,23.29 270 bottom
D99  342.38,23.29 270 bottom
D100  361.43,23.29 270 bottom
D101  1.86,13.76 90 bottom
D102  18.52,6.62 270 bottom
D103  37.58,6.62 270 bottom
D104  56.62,6.62 270 bottom
D105  75.67,6.62 270 bottom
D106  94.73,6.62 270 bottom
D107  113.78,6.62 270 bottom
D109  151.88,6.62 270 bottom
D110  170.92,6.62 270 bottom
D112  209.02,6.62 270 bottom
D113  228.07,6.62 270 bottom
D114  247.12,6.62 270 bottom
D115  266.18,6.62 270 bottom
D116  285.22,6.62 270 bottom
D117  304.27,6.62 270 bottom
D118  323.32,6.62 270 bottom
D119  342.38,6.62 270 bottom
D120  361.43,6.62 270 bottom
DBL_QUOTE  351.9,66.15 0 top
DELETE  313.8,104.25 0 top
DOLLAR  142.35,104.25 0 top
E  123.3,66.15 0 top
END  351.9,85.2 0 top
ENTER  294.75,47.1 0 top
EQUALS  294.75,85.2 0 top
ESCAPE  66.15,85.2 0 top
EXCLAMATION  85.2,104.25 0 top
F  142.35,47.1 0 top
F1  9,47.1 0 top
F2  9,66.15 0 top
F3  9,85.2 0 top
F4  9,104.25 0 top
F5  28.05,47.1 0 top
F6  28.05,66.15 0 top
F7  28.05,85.2 0 top
F8  28.05,104.25 180 top
F9  47.1,47.1 0 top
F10  47.1,66.15 0 top
F11  47.1,85.2 0 top
F12  47.1,104.25 0 top
FN  161.4,9 0 top
FORWARD_SLASH  256.65,9 0 top
G  161.4,47.1 0 top
GREATER_LESS  237.6,28.05 0 top
H  180.45,47.1 0 top
HASH  123.3,104.25 0 top
HOME  332.85,85.2 0 top
I  218.55,66.15 0 top
J  199.5,47.1 0 top
J1  20.45,76.95 270 top
J2  35.45,76.95 270 top
K  218.55,47.1 0 top
L  237.6,47.1 0 top
LEFT_ALT  104.25,9 0 top
LEFT_BRACKET  275.7,66.15 0 top
LEFT_CBRACE  332.85,104.25 0 top
LEFT_CTRL  66.15,9 0 top
LEFT_GUI  85.2,9 0 top
LEFT_PAREN  237.6,104.25 0 top
LEFT_SHIFT  66.15,28.05 0 top
LEFT_SPACE  132.82,9 0 top
LESS_GREATER  218.55,28.05 0 top
M  199.5,28.05 0 top
MINUS  275.7,85.2 0 top
N  180.45,28.05 0 top
NUMPAD_0  313.8,37.57 0 top
NUMPAD_1  332.85,9 0 top
NUMPAD_2  351.9,9 0 top
NUMPAD_3  370.95,9 0 top
NUMPAD_4  332.85,28.05 0 top
NUMPAD_5  351.9,28.05 0 top
NUMPAD_6  370.95,28.05 0 top
NUMPAD_7  332.85,47.1 0 top
NUMPAD_8  351.9,47.1 0 top
NUMPAD_9  370.95,47.1 0 top
O  237.6,66.15 0 top
P  256.65,66.15 0 top
PASTE  47.1,9 0 top
PAUSE_BREAK  47.1,28.05 0 top
PERCENT  161.4,104.25 0 top
PERIOD  237.6,9 0 top
PG_DOWN  370.95,66.15 0 top
PG_UP  370.95,85.2 0 top
PIPE  370.95,104.25 0 top
PLUS  294.75,104.25 0 top
PRINT_SCREEN  9,28.05 0 top
Q  85.2,66.15 0 top
QUESTION_MARK  256.65,28.05 0 top
R  142.35,66.15 0 top
RIGHT_BRACKET  294.75,66.15 0 top
RIGHT_CBRACE  351.9,104.25 0 top
RIGHT_PAREN  256.65,104.25 0 top
RIGHT_SHIFT  275.7,28.05 0 top
RIGHT_SPACE  189.97,9 0 top
S  104.25,47.1 0 top
SCROLL_LOCK  28.05,28.05 0 top
SEMICOLON  332.85,66.15 0 top
SINGE_QUOTE  275.7,47.1 0 top
T  161.4,66.15 0 top
TAB  66.15,66.15 0 top
TILDE  66.15,104.25 0 top
U  199.5,66.15 0 top
U$1  35.45,102.45 270 top
U$2  20.45,102.45 270 top
UNDESCORE  275.7,104.25 0 top
V  142.35,28.05 0 top
W  104.25,66.15 0 top
X  104.25,28.05 0 top
Y  180.45,66.15 0 top
Z  85.2,28.05 0 top

### Tracks (layer width: path | path; a pad name or v marks a point on that pad's centre or on a via)
C0
  Top 0.152: F4.MX2 11.54,105.36 11.58,105.32 11.58,103.18 11.54,103.13 F3.MX2 | F3.MX2 11.54,85.95 | F3.MX2 11.54,86.31 11.58,86.27 11.58,84.13 11.54,84.08 F2.MX2 11.54,67.26 11.58,67.22 11.58,65.08 11.54,65.03 F1.MX2 11.54,48.21 11.58,48.17 11.58,46.03 11.54,45.98 PRINT_SCREEN.MX2 11.54,29.16 11.58,29.12 11.58,26.98 11.54,26.93 CUT.MX2
  Bottom 0.152: F3.MX2 11.95,90.69 11.95,93.95 12.45,94.45 19.56,94.45 U$2.8
C1
  Top 0.152: F7.MX2 30.59,86.31 30.63,86.27 30.63,84.13 30.59,84.08 F6.MX2 30.59,67.26 30.63,67.22 30.63,65.08 30.59,65.03 F5.MX2 30.59,48.21 30.63,48.17 30.63,46.03 30.59,45.98 SCROLL_LOCK.MX2 30.59,29.16 30.63,29.12 30.63,26.98 30.59,26.93 COPY.MX2 | F8.MX2 25.51,95.36 F7.MX2 | F7.MX2 21.09,90.28 J1.1
C2
  Top 0.152: F12.MX2 49.64,105.36 49.68,105.32 49.68,103.18 49.64,103.13 49.64,93.45 | 49.64,93.45 F11.MX2 49.64,86.31 49.68,86.27 49.68,84.13 49.64,84.08 F10.MX2 49.64,67.26 49.68,67.22 49.68,65.08 49.64,65.03 F9.MX2 49.64,48.21 49.68,48.17 49.68,46.03 49.64,45.98 PAUSE_BREAK.MX2 49.64,29.16 49.68,29.12 49.68,26.98 49.64,26.93 PASTE.MX2 | U$1.8 49.53,93.56 49.64,93.45
C3
  Top 0.152: LEFT_CTRL.MX2 68.69,26.93 68.73,26.98 68.73,29.12 68.69,29.16 LEFT_SHIFT.MX2 68.69,45.98 68.73,46.03 68.73,48.17 68.69,48.21 CAPS_LOCK.MX2 68.69,65.03 68.73,65.08 68.73,67.22 68.69,67.26 TAB.MX2 68.69,84.08 68.73,84.13 68.73,86.27 68.69,86.31 ESCAPE.MX2 68.69,103.13 68.73,103.18 68.73,105.32 68.69,105.36 TILDE.MX2 51.76,109.33 50.26,110.83 49.02,110.83 48.14,109.95 48.14,108.94 44.52,105.32 44.52,104.18 36.43,96.1 U$1.7
C4
  Top 0.152: LEFT_GUI.MX2 87.74,26.93 87.78,26.98 87.78,29.12 87.74,29.16 Z.MX2 87.74,45.98 87.78,46.03 87.78,48.17 87.74,48.21 A.MX2 87.74,65.03 87.78,65.08 87.78,67.22 87.74,67.26 Q.MX2 87.74,84.08 87.78,84.13 87.78,86.27 87.74,86.31 1.MX2 87.74,103.13 87.78,103.18 87.78,105.32 87.74,105.36 EXCLAMATION.MX2 70.81,109.33 69.01,111.13 48.89,111.13 44.79,107.03 44.79,106.17 43.45,104.83 43.45,103.65 42.61,102.81 39.63,102.81 U$1.6
C5
  Top 0.152: LEFT_ALT.MX2 106.79,26.93 106.83,26.98 106.83,29.12 106.79,29.16 X.MX2 106.79,45.98 106.83,46.03 106.83,48.17 106.79,48.21 S.MX2 106.79,65.03 106.83,65.08 106.83,67.22 106.79,67.26 W.MX2 106.79,84.08 106.83,84.13 106.83,86.27 106.79,86.31 2.MX2 106.79,103.13 106.83,103.18 106.83,105.32 106.79,105.36 AT.MX2 89.86,109.33 87.75,111.44 45.82,111.44 35.56,101.18 U$1.5
C6
  Top 0.152: LEFT_SPACE.MX2 125.88,23.56 125.88,29.12 125.84,29.16 C.MX2 125.84,45.98 125.88,46.03 125.88,48.17 125.84,48.21 D.MX2 125.84,65.03 125.88,65.08 125.88,67.22 125.84,67.26 E.MX2 125.84,84.08 125.88,84.13 125.88,86.27 125.84,86.31 3.MX2 125.84,103.13 125.88,103.18 125.88,105.32 125.84,105.36 HASH.MX2 108.91,109.33 106.5,111.74 43.47,111.74 U$1.4
C7
  Top 0.152: V.MX2 144.89,45.98 144.93,46.03 144.93,48.17 144.89,48.21 F.MX2 144.89,65.03 144.93,65.08 144.93,67.22 144.89,67.26 R.MX2 144.89,84.08 144.93,84.13 144.93,86.27 144.89,86.31 4.MX2 144.89,103.13 144.93,103.18 144.93,105.32 144.89,105.36 DOLLAR.MX2 127.96,109.33 125.24,112.05 41.24,112.05 U$1.3
C8
  Top 0.152: FN.MX2 163.94,26.93 163.98,26.98 163.98,29.12 163.94,29.16 B.MX2 163.94,45.98 163.98,46.03 163.98,48.17 163.94,48.21 G.MX2 163.94,65.03 163.98,65.08 163.98,67.22 163.94,67.26 T.MX2 163.94,84.08 163.98,84.13 163.98,86.27 163.94,86.31 5.MX2 163.94,103.13 163.98,103.18 163.98,105.32 163.94,105.36 PERCENT.MX2 147.01,109.33 143.99,112.35 39,112.35 U$1.2
C9
  Top 0.152: RIGHT_SPACE.MX2 183.03,23.56 183.03,29.12 182.99,29.16 N.MX2 182.99,45.98 183.03,46.03 183.03,48.17 182.99,48.21 H.MX2 182.99,65.03 183.03,65.08 183.03,67.22 182.99,67.26 Y.MX2 182.99,84.08 183.03,84.13 183.03,86.27 182.99,86.31 6.MX2 182.99,103.13 183.03,103.18 183.03,105.32 182.99,105.36 CARROT.MX2 166.06,109.33 162.73,112.66 34.19,112.66 33.74,112.21 33.74,105.95 33.48,105.68 32.54,105.68 31.7,104.84 31.7,103.66 30.36,102.33 30.36,96.01 33.74,92.62 J2.1
C10
  Top 0.152: AMPERSAND.MX2 202.04,105.36 202.08,105.32 202.08,103.18 202.04,103.13 7.MX2 202.04,86.31 202.08,86.27 202.08,84.13 202.04,84.08 U.MX2 202.04,67.26 202.08,67.22 202.08,65.08 202.04,65.03 J.MX2 202.04,48.21 202.08,48.17 202.08,46.03 202.04,45.98 M.MX2
  Bottom 0.152: 7.MX2 199.37,92.95 40.45,92.95 35.88,88.38 J2.2
C11
  Top 0.152: ASTERICK.MX2 221.09,105.36 221.13,105.32 221.13,103.18 221.09,103.13 8.MX2 221.09,86.31 221.13,86.27 221.13,84.13 221.09,84.08 I.MX2 221.09,67.26 221.13,67.22 221.13,65.08 221.09,65.03 K.MX2 221.09,48.21 221.13,48.17 221.13,46.03 221.09,45.98 LESS_GREATER.MX2 221.09,29.16 221.13,29.12 221.13,26.98 221.09,26.93 COMMA.MX2
  Bottom 0.152: 8.MX2 204.16,90.28 202.66,88.78 200.62,88.78 196.95,92.45 42.45,92.45 37.95,87.95 37.95,83.26 J2.5
C12
  Top 0.152: LEFT_PAREN.MX2 240.14,105.36 240.18,105.32 240.18,103.18 240.14,103.13 9.MX2 240.14,86.31 240.18,86.27 240.18,84.13 240.14,84.08 O.MX2 240.14,67.26 240.18,67.22 240.18,65.08 240.14,65.03 L.MX2 240.14,48.21 240.18,48.17 240.18,46.03 240.14,45.98 GREATER_LESS.MX2 240.14,29.16 240.18,29.12 240.18,26.98 240.14,26.93 PERIOD.MX2
  Bottom 0.152: O.MX2 236.42,74.95 46.97,74.95 35.45,63.43 J2.12
C13
  Top 0.152: RIGHT_PAREN.MX2 259.19,105.36 259.23,105.32 259.23,103.18 259.19,103.13 0.MX2 259.19,86.31 259.23,86.27 259.23,84.13 259.19,84.08 P.MX2 259.19,67.26 259.23,67.22 259.23,65.08 259.19,65.03 COLON.MX2 259.19,48.21 259.23,48.17 259.23,46.03 259.19,45.98 QUESTION_MARK.MX2 259.19,29.16 259.23,29.12 259.23,26.98 259.19,26.93 FORWARD_SLASH.MX2
  Bottom 0.152: J2.11 35.69,65.52 45.62,75.45 254.97,75.45 P.MX2
C14
  Top 0.152: UNDESCORE.MX2 278.24,105.36 278.28,105.32 278.28,103.18 278.24,103.13 MINUS.MX2 278.24,86.31 278.28,86.27 278.28,84.13 278.24,84.08 LEFT_BRACKET.MX2 278.24,67.26 278.28,67.22 278.28,65.08 278.24,65.03 SINGE_QUOTE.MX2 278.24,48.21 278.28,48.17 278.28,46.03 278.24,45.98 RIGHT_SHIFT.MX2 278.24,29.16 278.28,29.12 278.28,26.98 278.24,26.93 ARROW_LEFT.MX2
  Bottom 0.152: LEFT_BRACKET.MX2 273.52,75.95 43.34,75.95 J2.10
C15
  Top 0.152: PLUS.MX2 297.29,105.36 297.33,105.32 297.33,103.18 297.29,103.13 EQUALS.MX2 297.29,86.31 297.33,86.27 297.33,84.13 297.29,84.08 RIGHT_BRACKET.MX2 297.29,67.26 297.33,67.22 297.33,65.08 297.29,65.03 ENTER.MX2 297.29,48.21 297.33,48.17 297.33,46.03 297.29,45.98 ARROW_UP.MX2 297.29,29.16 297.33,29.12 297.33,26.98 297.29,26.93 ARROW_DOWN.MX2
  Bottom 0.152: J2.9 41.3,76.45 292.07,76.45 RIGHT_BRACKET.MX2
C16
  Top 0.152: DELETE.MX2 316.34,105.36 316.38,105.32 316.38,103.18 316.34,103.13 BACKSPACE.MX2 316.34,86.31 316.38,86.27 316.38,84.13 316.34,84.08 BACK_SLASH.MX2 316.34,67.26 316.38,67.22 316.38,65.08 316.34,65.03 NUMPAD_0.MX2 316.34,38.69 316.38,38.64 316.38,36.5 316.34,36.46 ARROW_RIGHT.MX2
  Bottom 0.152: BACK_SLASH.MX2 310.62,76.95 39.26,76.95 J2.8
C17
  Top 0.152: LEFT_CBRACE.MX2 335.39,105.36 335.43,105.32 335.43,103.18 335.39,103.13 HOME.MX2 335.39,86.31 335.43,86.27 335.43,84.13 335.39,84.08 SEMICOLON.MX2 335.39,67.26 335.43,67.22 335.43,65.08 335.39,65.03 NUMPAD_7.MX2 335.39,48.21 335.43,48.17 335.43,46.03 335.39,45.98 NUMPAD_4.MX2 335.39,29.16 335.43,29.12 335.43,26.98 335.39,26.93 NUMPAD_1.MX2
  Bottom 0.152: SEMICOLON.MX2 329.17,77.45 37.22,77.45 J2.7
C18
  Top 0.152: RIGHT_CBRACE.MX2 354.44,105.36 354.48,105.32 354.48,103.18 354.44,103.13 END.MX2 354.44,86.31 354.48,86.27 354.48,84.13 354.44,84.08 DBL_QUOTE.MX2 354.44,67.26 354.48,67.22 354.48,65.08 354.44,65.03 NUMPAD_8.MX2 354.44,48.21 354.48,48.17 354.48,46.03 354.44,45.98 NUMPAD_5.MX2 354.44,29.16 354.48,29.12 354.48,26.98 354.44,26.93 NUMPAD_2.MX2
  Bottom 0.152: DBL_QUOTE.MX2 347.72,77.95 37.95,77.95 37.68,78.22 J2.6
C19  (via drill 0.35)
  Top 0.152: PIPE.MX2 373.49,105.36 373.53,105.32 373.53,103.18 373.49,103.13 PG_UP.MX2 373.49,86.31 373.53,86.27 373.53,71.86 373.95,71.45 373.73,71.23 PG_DOWN.MX2 373.49,67.26 373.53,67.22 373.53,65.08 373.49,65.03 NUMPAD_9.MX2 373.49,48.21 373.53,48.17 373.53,46.03 373.49,45.98 NUMPAD_6.MX2 373.49,29.16 373.53,29.12 373.53,26.98 373.49,26.93 NUMPAD_3.MX2 | J1.12 20.45,59.95 v19.45,58.95
  Bottom 0.152: v19.45,58.95 366.72,58.95 NUMPAD_9.MX2
N$1
  Bottom 0.152: D1.A 1.86,102.95 1.86,102.99 1.86,104.21 3.33,105.68 4.08,105.68 F4.MX1
N$2
  Bottom 0.152: D2.A 31.9,101.67 F8.MX1
N$3
  Bottom 0.152: F12.MX1 44.08,106 D3.A
N$4
  Bottom 0.152: 56.62,102.99 56.62,102.95 | 56.62,102.95 D4.A | TILDE.MX1 60.47,106.79 56.62,102.95
N$5
  Bottom 0.152: 75.67,102.99 75.67,102.95 | 75.67,102.95 D5.A | EXCLAMATION.MX1 79.52,106.79 75.67,102.95
N$6
  Bottom 0.152: 94.73,102.99 94.73,102.95 | 94.73,102.95 D6.A | AT.MX1 98.56,106.79 94.73,102.95
N$7
  Bottom 0.152: D7.A 113.78,102.99 117.58,106.79 HASH.MX1
N$8
  Bottom 0.152: 132.82,102.99 132.82,102.95 | 132.82,102.95 D8.A | DOLLAR.MX1 136.66,106.79 132.82,102.95
N$9
  Bottom 0.152: 151.88,102.99 151.88,102.95 | 151.88,102.95 D9.A | PERCENT.MX1 155.71,106.79 151.88,102.95
N$10
  Bottom 0.152: 170.92,102.99 170.92,102.95 | 170.92,102.95 D10.A | CARROT.MX1 174.76,106.79 170.92,102.95
N$11
  Bottom 0.152: 189.97,102.99 189.97,102.95 | 189.97,102.95 D11.A | AMPERSAND.MX1 193.81,106.79 189.97,102.95
N$12
  Bottom 0.152: 209.02,102.99 209.02,102.95 | 209.02,102.95 D12.A | ASTERICK.MX1 212.86,106.79 209.02,102.95
N$13
  Bottom 0.152: 228.07,102.99 228.07,102.95 | 228.07,102.95 D13.A | LEFT_PAREN.MX1 231.91,106.79 228.07,102.95
N$14
  Bottom 0.152: D14.A 247.12,102.99 250.93,106.79 RIGHT_PAREN.MX1
N$15
  Bottom 0.152: 266.18,102.99 266.18,102.95 | 266.18,102.95 D15.A | UNDESCORE.MX1 270.01,106.79 266.18,102.95
N$16
  Bottom 0.152: 285.22,102.99 285.22,102.95 | 285.22,102.95 D16.A | PLUS.MX1 289.06,106.79 285.22,102.95
N$17
  Bottom 0.152: D17.A 304.27,102.99 308.08,106.79 DELETE.MX1
N$18
  Bottom 0.152: 323.32,102.99 323.32,102.95 | 323.32,102.95 D18.A | LEFT_CBRACE.MX1 327.16,106.79 323.32,102.95
N$19
  Bottom 0.152: 342.38,102.99 342.38,102.95 | 342.38,102.95 D19.A | RIGHT_CBRACE.MX1 346.21,106.79 342.38,102.95
N$20
  Bottom 0.152: D20.A 361.43,102.99 365.23,106.79 PIPE.MX1
N$21
  Bottom 0.152: D21.A 1.86,83.94 1.86,85.16 3.33,86.63 4.08,86.63 F3.MX1
N$22
  Bottom 0.152: F7.MX1 25.12,86.86 D22.A
N$23
  Bottom 0.152: D23.A 39.08,85.44 41.38,87.74 F11.MX1
N$24
  Bottom 0.152: D24.A 56.62,83.94 60.43,87.74 ESCAPE.MX1
N$25
  Bottom 0.152: D25.A 75.67,83.94 79.48,87.74 1.MX1
N$26
  Bottom 0.152: D26.A 94.73,83.94 98.53,87.74 2.MX1
N$27
  Bottom 0.152: D27.A 113.78,83.94 117.58,87.74 3.MX1
N$28
  Bottom 0.152: D28.A 132.82,83.94 136.63,87.74 4.MX1
N$29
  Bottom 0.152: D29.A 151.88,83.94 155.68,87.74 5.MX1
N$30
  Bottom 0.152: D30.A 170.92,83.94 174.73,87.74 6.MX1
N$31
  Bottom 0.152: D31.A 189.97,83.94 193.78,87.74 7.MX1
N$32
  Bottom 0.152: D32.A 209.02,83.94 212.83,87.74 8.MX1
N$33
  Bottom 0.152: D33.A 228.07,83.94 231.88,87.74 9.MX1
N$34
  Bottom 0.152: D34.A 247.12,83.94 250.93,87.74 0.MX1
N$35
  Bottom 0.152: D35.A 266.18,83.94 269.98,87.74 MINUS.MX1
N$36
  Bottom 0.152: D36.A 285.22,83.94 289.03,87.74 EQUALS.MX1
N$37
  Bottom 0.152: BACKSPACE.MX1 308.08,87.74 304.37,84.03 | 304.37,84.03 304.27,83.94 | D37.A 304.37,82.18 304.37,84.03
N$38
  Bottom 0.152: D38.A 323.32,83.94 327.13,87.74 HOME.MX1
N$39
  Bottom 0.152: D39.A 342.38,83.94 346.18,87.74 END.MX1
N$40
  Bottom 0.152: D40.A 361.43,83.94 365.23,87.74 PG_UP.MX1
N$41
  Bottom 0.152: D41.A 1.86,64.89 1.86,66.11 3.33,67.58 4.08,67.58 F2.MX1
N$42
  Bottom 0.152: F6.MX1 25.03,67.9 D42.A
N$43
  Bottom 0.152: D43.A 40.44,67.75 41.38,68.69 F10.MX1
N$44
  Bottom 0.152: D44.A 56.62,64.89 60.43,68.69 TAB.MX1
N$45
  Bottom 0.152: D45.A 75.67,64.89 79.48,68.69 Q.MX1
N$46
  Bottom 0.152: D46.A 94.73,64.89 98.53,68.69 W.MX1
N$47
  Bottom 0.152: D47.A 113.78,64.89 117.58,68.69 E.MX1
N$48
  Bottom 0.152: D48.A 132.82,64.89 136.63,68.69 R.MX1
N$49
  Bottom 0.152: D49.A 151.88,64.89 155.68,68.69 T.MX1
N$50
  Bottom 0.152: D50.A 170.92,64.89 174.73,68.69 Y.MX1
N$51
  Bottom 0.152: D51.A 189.97,64.89 193.78,68.69 U.MX1
N$52
  Bottom 0.152: D52.A 209.02,64.89 212.83,68.69 I.MX1
N$53
  Bottom 0.152: D53.A 228.07,64.89 231.88,68.69 O.MX1
N$54
  Bottom 0.152: D54.A 247.12,64.89 250.93,68.69 P.MX1
N$55
  Bottom 0.152: D55.A 266.18,64.89 269.98,68.69 LEFT_BRACKET.MX1
N$56
  Bottom 0.152: D56.A 285.22,64.89 289.03,68.69 RIGHT_BRACKET.MX1
N$57
  Bottom 0.152: D57.A 304.27,64.89 308.08,68.69 BACK_SLASH.MX1
N$58
  Bottom 0.152: D58.A 323.32,64.89 327.13,68.69 SEMICOLON.MX1
N$59
  Bottom 0.152: D59.A 342.38,64.89 346.18,68.69 DBL_QUOTE.MX1
N$60
  Bottom 0.152: D60.A 361.43,64.89 365.23,68.69 PG_DOWN.MX1
N$61
  Bottom 0.152: D61.A 1.86,45.84 1.86,47.06 3.33,48.53 4.08,48.53 F1.MX1
N$62
  Bottom 0.152: F5.MX1 25.03,48.85 D62.A
N$63
  Bottom 0.152: D63.A 37.58,45.84 41.38,49.64 F9.MX1
N$64
  Bottom 0.152: D64.A 56.62,45.84 60.43,49.64 CAPS_LOCK.MX1
N$65
  Bottom 0.152: D65.A 75.67,45.84 79.48,49.64 A.MX1
N$66
  Bottom 0.152: D66.A 94.73,45.84 98.53,49.64 S.MX1
N$67
  Bottom 0.152: D67.A 113.78,45.84 117.58,49.64 D.MX1
N$68
  Bottom 0.152: D68.A 132.82,45.84 136.63,49.64 F.MX1
N$69
  Bottom 0.152: D69.A 151.88,45.84 155.68,49.64 G.MX1
N$70
  Bottom 0.152: D70.A 170.92,45.84 174.73,49.64 H.MX1
N$71
  Bottom 0.152: D71.A 189.97,45.84 193.78,49.64 J.MX1
N$72
  Bottom 0.152: D72.A 209.02,45.84 212.83,49.64 K.MX1
N$73
  Bottom 0.152: D73.A 228.07,45.84 231.88,49.64 L.MX1
N$74
  Bottom 0.152: D74.A 247.12,45.84 250.93,49.64 COLON.MX1
N$75
  Bottom 0.152: D75.A 266.18,45.84 269.98,49.64 SINGE_QUOTE.MX1
N$76
  Bottom 0.152: D76.A 285.22,45.84 289.03,49.64 ENTER.MX1
N$77
  Bottom 0.152: D78.A 323.32,42.95 323.32,43.45 323.32,44.82 328.14,49.64 NUMPAD_7.MX1
N$78
  Bottom 0.152: D79.A 342.38,45.84 346.18,49.64 NUMPAD_8.MX1
N$79
  Bottom 0.152: D80.A 361.43,45.84 365.23,49.64 NUMPAD_9.MX1
N$80
  Bottom 0.152: D81.A 1.86,28.01 3.33,29.48 4.08,29.48 PRINT_SCREEN.MX1
N$81
  Bottom 0.152: SCROLL_LOCK.MX1 25.03,29.8 D82.A
N$82
  Bottom 0.152: D83.A 37.58,26.79 41.38,30.59 PAUSE_BREAK.MX1
N$83
  Bottom 0.152: D84.A 56.62,26.79 60.43,30.59 LEFT_SHIFT.MX1
N$84
  Bottom 0.152: D85.A 75.67,26.79 79.48,30.59 Z.MX1
N$85
  Bottom 0.152: D86.A 94.73,26.79 98.53,30.59 X.MX1
N$86
  Bottom 0.152: D87.A 113.78,26.79 117.58,30.59 C.MX1
N$87
  Bottom 0.152: D88.A 132.82,26.79 136.63,30.59 V.MX1
N$88
  Bottom 0.152: D89.A 151.88,26.79 155.68,30.59 B.MX1
N$89
  Bottom 0.152: D90.A 170.92,26.79 174.73,30.59 N.MX1
N$90
  Bottom 0.152: D91.A 189.97,26.79 193.78,30.59 M.MX1
N$91
  Bottom 0.152: D92.A 209.02,26.79 212.83,30.59 LESS_GREATER.MX1
N$92
  Bottom 0.152: D93.A 228.07,26.79 231.88,30.59 GREATER_LESS.MX1
N$93
  Bottom 0.152: D94.A 247.12,26.79 250.93,30.59 QUESTION_MARK.MX1
N$94
  Bottom 0.152: D95.A 266.18,26.79 269.98,30.59 RIGHT_SHIFT.MX1
N$95
  Bottom 0.152: D96.A 285.22,26.79 289.03,30.59 ARROW_UP.MX1
N$96
  Bottom 0.152: D97.A 304.27,38.69 305.7,40.11 NUMPAD_0.MX1
N$97
  Bottom 0.152: D98.A 325.71,26.79 325.71,28.01 327.18,29.48 327.93,29.48 NUMPAD_4.MX1
N$98
  Bottom 0.152: D99.A 342.38,26.79 346.18,30.59 NUMPAD_5.MX1
N$99
  Bottom 0.152: D100.A 361.43,26.79 365.23,30.59 NUMPAD_6.MX1
N$100
  Bottom 0.152: D101.A 1.86,10.26 3.13,11.54 CUT.MX1
N$101
  Bottom 0.152: D102.A 18.52,10.12 19.95,11.54 COPY.MX1
N$102
  Bottom 0.152: D103.A 37.58,10.12 39,11.54 PASTE.MX1
N$103
  Bottom 0.152: D104.A 56.62,10.12 58.05,11.54 LEFT_CTRL.MX1
N$104
  Bottom 0.152: D105.A 75.67,10.12 77.1,11.54 LEFT_GUI.MX1
N$105
  Bottom 0.152: D106.A 94.73,10.12 96.15,11.54 LEFT_ALT.MX1
N$106
  Bottom 0.152: D107.A 113.78,10.12 115.2,11.54 LEFT_SPACE.MX1
N$107
  Bottom 0.152: D109.A 151.88,10.12 153.3,11.54 FN.MX1
N$108
  Bottom 0.152: D110.A 170.92,10.12 172.35,11.54 RIGHT_SPACE.MX1
N$109
  Bottom 0.152: D112.A 209.02,10.12 210.45,11.54 COMMA.MX1
N$110
  Bottom 0.152: D113.A 228.07,10.12 229.5,11.54 PERIOD.MX1
N$111
  Bottom 0.152: D114.A 247.12,10.12 248.55,11.54 FORWARD_SLASH.MX1
N$112
  Bottom 0.152: D115.A 266.18,10.12 267.6,11.54 ARROW_LEFT.MX1
N$113
  Bottom 0.152: D116.A 285.22,10.12 286.65,11.54 ARROW_DOWN.MX1
N$114
  Bottom 0.152: D117.A 304.27,10.12 305.7,11.54 ARROW_RIGHT.MX1
N$115
  Bottom 0.152: D118.A 323.32,10.12 324.75,11.54 NUMPAD_1.MX1
N$116
  Bottom 0.152: D119.A 342.38,10.12 343.8,11.54 NUMPAD_2.MX1
N$117
  Bottom 0.152: D120.A 361.43,10.12 362.85,11.54 NUMPAD_3.MX1
R0
  Bottom 0.152: D20.C 361.04,97.47 342.76,97.47 D19.C D18.C D17.C D16.C D15.C D14.C D13.C D12.C D11.C D10.C D9.C D8.C D7.C D6.C D5.C D4.C D3.C 40.08,97.85 37.03,94.81 D2.C 6.49,94.81 6.45,94.85 | U$2.2 18.6,106.95 7.95,106.95 6.45,105.45 6.45,105.35 6.42,105.32 6.42,94.89 6.45,94.85 | D1.C 4.86,94.85 6.45,94.85
R1  (via drill 0.5)
  Top 0.152: v6.92,93.95 6.42,94.46 6.42,105.32 6.45,105.35 6.45,105.45 7.95,106.95 7.95,109.95 8.95,110.95 15.76,110.95 U$2.3
  Bottom 0.152: D40.C D39.C D38.C D37.C D36.C D35.C D34.C D33.C D32.C D31.C D30.C D29.C D28.C D27.C D26.C D25.C D24.C D23.C 38.43,79.45 34.45,79.45 31.95,76.95 D22.C | D22.C 6.45,76.95 6.45,78.8 | 6.45,78.8 D21.C | 6.45,78.8 6.45,84.09 6.42,84.13 6.42,86.41 6.92,86.92 v6.92,93.95 | D22.C 31.95,76.95
R2  (via drill 0.5)
  Top 0.152: v13.43,75.96 13.43,83.82 12.65,84.6 12.65,85.79 13.45,86.6 13.45,100.95 16.45,103.95 20.22,103.95 U$2.4
  Bottom 0.152: D41.C 12.45,59.75 | 12.45,59.75 D42.C D43.C D44.C D45.C D46.C D47.C D48.C D49.C D50.C D51.C D52.C D53.C D54.C D55.C D56.C D57.C D58.C D59.C D60.C | 12.45,59.75 12.45,68.95 13.43,69.93 v13.43,75.96
R3  (via drill 0.5)
  Top 0.152: v15.55,58.83 v15.54,58.83 15.54,86.86 15.45,86.95 15.45,98.95 17.68,101.18 U$2.5
  Bottom 0.152: D80.C D79.C 325.71,40.7 D78.C 320.94,40.7 311.52,40.7 310.61,41.61 309.37,41.61 308.46,40.7 D76.C D75.C D74.C D73.C D72.C D71.C D70.C D69.C D68.C D67.C D66.C D65.C D64.C D63.C D62.C 15.53,40.7 15.53,58.81 v15.55,58.83 | 15.45,40.7 D61.C
R4  (via drill 0.5)
  Top 0.152: v16.45,39.95 16.45,96.95 18.14,98.64 U$2.6
  Bottom 0.152: D81.C 16.45,21.65 | 16.45,21.65 D82.C D83.C D84.C D85.C D86.C D87.C D88.C D89.C D90.C D91.C D92.C D93.C D94.C D95.C D96.C 292.01,21.65 298.4,28.04 298.4,28.64 299.24,29.48 300.2,29.48 D97.C 316.18,21.65 D98.C D99.C D100.C | 16.45,21.65 v16.45,39.95
R5  (via drill 0.5)
  Top 0.152: v16.95,20.95 16.95,39.48 17.13,39.67 17.13,40.23 16.95,40.41 16.95,94.95 18.1,96.1 U$2.7
  Bottom 0.152: D120.C D119.C D118.C D117.C D116.C D115.C D114.C D113.C D112.C D110.C D109.C D107.C D106.C D105.C D104.C D103.C D102.C 16.95,4.98 | D101.C 4.21,13.04 5.81,13.04 6.69,12.16 6.69,10.92 6.42,10.64 6.42,7.93 9.36,4.98 16.95,4.98 | 16.95,4.98 v16.95,20.95

### Text on the board
bValues: Design by FruityKeeb | BOP v1